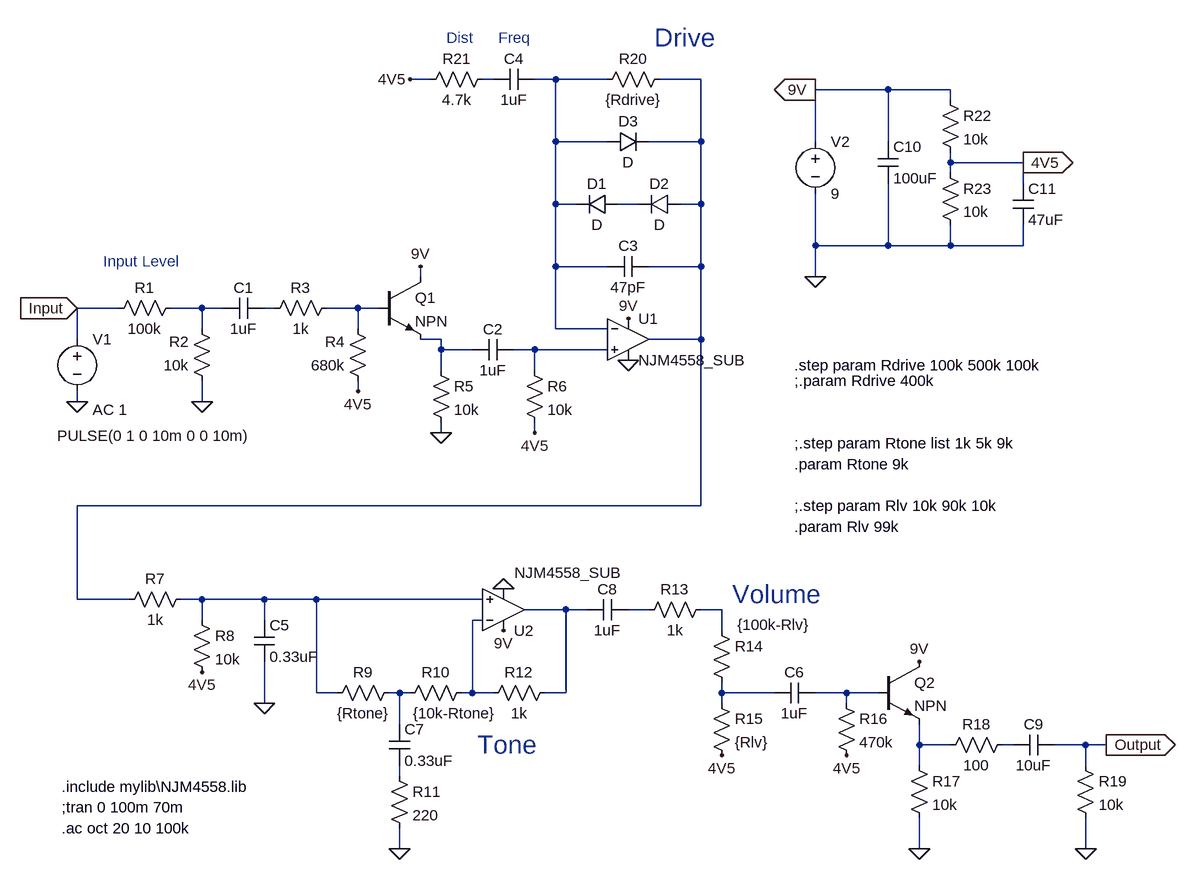
[diagram p0: schematic TS_OD1.asc]
TS_OD1.asc, the LTspice schematic file:
Version 4
SHEET 1 2708 1040
WIRE 768 -592 736 -592
WIRE 864 -592 848 -592
WIRE 960 -592 928 -592
WIRE 1040 -592 960 -592
WIRE 1184 -592 1120 -592
WIRE 1472 -576 1360 -576
WIRE 1568 -576 1472 -576
WIRE 1568 -560 1568 -576
WIRE 960 -496 960 -592
WIRE 1040 -496 960 -496
WIRE 1184 -496 1184 -592
WIRE 1184 -496 1104 -496
WIRE 1360 -496 1360 -576
WIRE 1472 -496 1472 -576
WIRE 1568 -464 1568 -480
WIRE 1680 -464 1568 -464
WIRE 1568 -448 1568 -464
WIRE 1680 -432 1680 -464
WIRE 960 -400 960 -496
WIRE 992 -400 960 -400
WIRE 1088 -400 1056 -400
WIRE 1184 -400 1184 -496
WIRE 1184 -400 1152 -400
WIRE 1360 -336 1360 -416
WIRE 1472 -336 1472 -432
WIRE 1472 -336 1360 -336
WIRE 1568 -336 1568 -368
WIRE 1568 -336 1472 -336
WIRE 1680 -336 1680 -368
WIRE 1680 -336 1568 -336
WIRE 960 -304 960 -400
WIRE 1040 -304 960 -304
WIRE 1184 -304 1184 -400
WIRE 1184 -304 1104 -304
WIRE 752 -288 752 -304
WIRE 1360 -288 1360 -336
WIRE 288 -240 224 -240
WIRE 416 -240 368 -240
WIRE 448 -240 416 -240
WIRE 528 -240 512 -240
WIRE 656 -240 608 -240
WIRE 688 -240 656 -240
WIRE 416 -208 416 -240
WIRE 656 -208 656 -240
WIRE 960 -208 960 -304
WIRE 1040 -208 960 -208
WIRE 224 -192 224 -240
WIRE 784 -192 752 -192
WIRE 1184 -192 1184 -304
WIRE 1184 -192 1104 -192
WIRE 784 -176 784 -192
WIRE 832 -176 784 -176
WIRE 928 -176 896 -176
WIRE 1040 -176 928 -176
WIRE 784 -144 784 -176
WIRE 928 -144 928 -176
WIRE 656 -112 656 -128
WIRE 224 -96 224 -112
WIRE 416 -96 416 -128
WIRE 784 -48 784 -64
WIRE 928 -48 928 -64
WIRE 1184 64 1184 -192
WIRE 1184 64 224 64
WIRE 224 208 224 64
WIRE 304 208 224 208
WIRE 416 208 384 208
WIRE 512 208 416 208
WIRE 592 208 512 208
WIRE 848 208 592 208
WIRE 976 224 912 224
WIRE 1008 224 976 224
WIRE 1104 224 1072 224
WIRE 1216 224 1184 224
WIRE 416 240 416 208
WIRE 512 240 512 208
WIRE 848 240 832 240
WIRE 1216 256 1216 224
WIRE 592 352 592 208
WIRE 624 352 592 352
WIRE 720 352 704 352
WIRE 736 352 720 352
WIRE 832 352 832 240
WIRE 832 352 816 352
WIRE 864 352 832 352
WIRE 976 352 976 224
WIRE 976 352 944 352
WIRE 1216 352 1216 336
WIRE 1296 352 1216 352
WIRE 1408 352 1360 352
WIRE 1456 352 1408 352
WIRE 512 368 512 304
WIRE 1216 368 1216 352
WIRE 1408 368 1408 352
WIRE 720 400 720 352
WIRE 1520 432 1520 400
WIRE 1568 432 1520 432
WIRE 1664 432 1648 432
WIRE 1776 432 1728 432
WIRE 1808 432 1776 432
WIRE 1520 464 1520 432
WIRE 1776 464 1776 432
WIRE 720 480 720 464
WIRE 720 592 720 560
WIRE 1520 592 1520 544
WIRE 1776 592 1776 544
FLAG 416 320 4V5
FLAG 512 368 0
FLAG 720 592 0
FLAG 1216 448 4V5
FLAG 1520 592 0
FLAG 1520 304 9V
FLAG 1408 448 4V5
FLAG 1776 592 0
FLAG 1808 432 Output
IOPIN 1808 432 Out
FLAG 224 -240 Input
IOPIN 224 -240 In
FLAG 880 256 9V
FLAG 880 192 0
FLAG 1360 -288 0
FLAG 1360 -576 9V
IOPIN 1360 -576 Out
FLAG 1680 -464 4V5
IOPIN 1680 -464 Out
FLAG 752 -304 9V
FLAG 736 -592 4V5
FLAG 224 -96 0
FLAG 416 -96 0
FLAG 656 -112 4V5
FLAG 784 -48 0
FLAG 928 -48 4V5
FLAG 1072 -224 9V
FLAG 1072 -160 0
SYMBOL voltage 224 -208 R0
WINDOW 123 24 124 Left 2
WINDOW 39 0 0 Left 2
WINDOW 3 -31 164 Left 2
SYMATTR Value2 AC 1
SYMATTR Value PULSE(0 1 0 10m 0 0 10m)
SYMATTR InstName V1
SYMBOL res 400 192 R90
WINDOW 0 0 56 VBottom 2
WINDOW 3 32 56 VTop 2
SYMATTR InstName R7
SYMATTR Value 1k
SYMBOL res 400 224 R0
SYMATTR InstName R8
SYMATTR Value 10k
SYMBOL cap 496 240 R0
SYMATTR InstName C5
SYMATTR Value 0.33uF
SYMBOL Opamps\\opamp2 880 288 M180
WINDOW 3 17 121 Left 2
SYMATTR Value NJM4558_SUB
SYMATTR InstName U2
SYMBOL res 720 336 R90
WINDOW 0 0 56 VBottom 2
WINDOW 3 32 56 VTop 2
SYMATTR InstName R9
SYMATTR Value {Rtone}
SYMBOL res 832 336 R90
WINDOW 0 0 56 VBottom 2
WINDOW 3 32 27 VTop 2
SYMATTR InstName R10
SYMATTR Value {10k-Rtone}
SYMBOL cap 704 400 R0
SYMATTR InstName C7
SYMATTR Value 0.33uF
SYMBOL res 704 464 R0
SYMATTR InstName R11
SYMATTR Value 220
SYMBOL res 960 336 R90
WINDOW 0 0 56 VBottom 2
WINDOW 3 32 56 VTop 2
SYMATTR InstName R12
SYMATTR Value 1k
SYMBOL cap 1072 208 R90
WINDOW 0 0 32 VBottom 2
WINDOW 3 32 32 VTop 2
SYMATTR InstName C8
SYMATTR Value 1uF
SYMBOL res 1200 208 R90
WINDOW 0 0 56 VBottom 2
WINDOW 3 32 56 VTop 2
SYMATTR InstName R13
SYMATTR Value 1k
SYMBOL res 1200 240 R0
WINDOW 3 40 7 Left 2
SYMATTR Value {100k-Rlv}
SYMATTR InstName R14
SYMBOL res 1200 352 R0
SYMATTR InstName R15
SYMATTR Value {Rlv}
SYMBOL cap 1360 336 R90
WINDOW 0 0 32 VBottom 2
WINDOW 3 32 32 VTop 2
SYMATTR InstName C6
SYMATTR Value 1uF
SYMBOL res 1392 352 R0
SYMATTR InstName R16
SYMATTR Value 470k
SYMBOL npn 1456 304 R0
SYMATTR InstName Q2
SYMBOL res 1504 448 R0
SYMATTR InstName R17
SYMATTR Value 10k
SYMBOL res 1664 416 R90
WINDOW 0 0 56 VBottom 2
WINDOW 3 32 56 VTop 2
SYMATTR InstName R18
SYMATTR Value 100
SYMBOL cap 1728 416 R90
WINDOW 0 0 32 VBottom 2
WINDOW 3 32 32 VTop 2
SYMATTR InstName C9
SYMATTR Value 10uF
SYMBOL res 1760 448 R0
SYMATTR InstName R19
SYMATTR Value 10k
SYMBOL voltage 1360 -512 R0
SYMATTR InstName V2
SYMATTR Value 9
SYMBOL res 384 -256 R90
WINDOW 0 0 56 VBottom 2
WINDOW 3 32 56 VTop 2
SYMATTR InstName R1
SYMATTR Value 100k
SYMBOL res 432 -112 R180
WINDOW 0 36 76 Left 2
WINDOW 3 36 40 Left 2
SYMATTR InstName R2
SYMATTR Value 10k
SYMBOL cap 512 -256 R90
WINDOW 0 0 32 VBottom 2
WINDOW 3 32 32 VTop 2
SYMATTR InstName C1
SYMATTR Value 1uF
SYMBOL res 624 -256 R90
WINDOW 0 0 56 VBottom 2
WINDOW 3 32 56 VTop 2
SYMATTR InstName R3
SYMATTR Value 1k
SYMBOL res 672 -112 R180
WINDOW 0 36 76 Left 2
WINDOW 3 36 40 Left 2
SYMATTR InstName R4
SYMATTR Value 680k
SYMBOL npn 688 -288 R0
SYMATTR InstName Q1
SYMBOL res 768 -160 R0
SYMATTR InstName R5
SYMATTR Value 10k
SYMBOL cap 896 -192 R90
WINDOW 0 0 32 VBottom 2
WINDOW 3 32 32 VTop 2
SYMATTR InstName C2
SYMATTR Value 1uF
SYMBOL res 912 -160 R0
SYMATTR InstName R6
SYMATTR Value 10k
SYMBOL cap 1104 -320 R90
WINDOW 0 0 32 VBottom 2
WINDOW 3 32 32 VTop 2
SYMATTR InstName C3
SYMATTR Value 47pF
SYMBOL diode 1056 -416 R90
WINDOW 0 0 32 VBottom 2
WINDOW 3 32 32 VTop 2
SYMATTR InstName D1
SYMBOL diode 1152 -416 R90
WINDOW 0 0 32 VBottom 2
WINDOW 3 32 32 VTop 2
SYMATTR InstName D2
SYMBOL diode 1040 -480 R270
WINDOW 0 32 32 VTop 2
WINDOW 3 0 32 VBottom 2
SYMATTR InstName D3
SYMBOL res 1136 -608 R90
WINDOW 0 0 56 VBottom 2
WINDOW 3 32 56 VTop 2
SYMATTR InstName R20
SYMATTR Value {Rdrive}
SYMBOL cap 928 -608 R90
WINDOW 0 0 32 VBottom 2
WINDOW 3 32 32 VTop 2
SYMATTR InstName C4
SYMATTR Value 1uF
SYMBOL res 864 -608 R90
WINDOW 0 0 56 VBottom 2
WINDOW 3 32 56 VTop 2
SYMATTR InstName R21
SYMATTR Value 4.7k
SYMBOL cap 1456 -496 R0
SYMATTR InstName C10
SYMATTR Value 100uF
SYMBOL res 1552 -576 R0
SYMATTR InstName R22
SYMATTR Value 10k
SYMBOL res 1552 -464 R0
SYMATTR InstName R23
SYMATTR Value 10k
SYMBOL cap 1664 -432 R0
SYMATTR InstName C11
SYMATTR Value 47uF
SYMBOL Opamps\\opamp2 1072 -256 R0
SYMATTR InstName U1
SYMATTR Value NJM4558_SUB
TEXT 840 432 Left 4 ;Tone
TEXT 1232 200 Left 4 ;Volume
TEXT 200 496 Left 2 !.include mylib\\NJM4558.lib
TEXT 200 528 Left 2 !;tran 0 100m 70m
TEXT 200 560 Left 2 !.ac oct 20 10 100k
TEXT 1328 -32 Left 2 !;.step param Rtone list 1k 5k 9k
TEXT 1328 64 Left 2 !;.step param Rlv 10k 90k 10k
TEXT 1328 0 Left 2 !.param Rtone 9k
TEXT 1328 96 Left 2 !.param Rlv 99k
TEXT 1328 -128 Left 2 !;.param Rdrive 400k
TEXT 1328 -152 Left 2 !.step param Rdrive 100k 500k 100k
TEXT 872 -656 Left 2 ;Freq
TEXT 792 -656 Left 2 ;Dist
TEXT 264 -312 Left 2 ;Input Level
TEXT 1112 -656 Left 4 ;Drive

The netlist it stands for:
* TS_OD1.asc
V1 Input 0 PULSE(0 1 0 10m 0 0 10m) AC 1
R7 N010 N003 1k
R8 N010 4V5 10k
C5 N010 0 0.33uF
XU2 N010 N014 9V 0 N011 NJM4558_SUB  ; pins In+ In- V+ V- OUT
R9 N015 N010 {Rtone}
R10 N014 N015 {10k-Rtone}
C7 N015 N020 0.33uF
R11 N020 0 220
R12 N011 N014 1k
C8 N012 N011 1uF
R13 N013 N012 1k
R14 N013 N016 {100k-Rlv}
R15 N016 4V5 {Rlv}
C6 N017 N016 1uF
R16 N017 4V5 470k
Q2 9V N017 N018 0 NPN
R17 N018 0 10k
R18 N019 N018 100
C9 Output N019 10uF
R19 Output 0 10k
V2 9V 0 9
R1 N005 Input 100k
R2 0 N005 10k
C1 N006 N005 1uF
R3 N007 N006 1k
R4 4V5 N007 680k
Q1 9V N007 N008 0 NPN
R5 N008 0 10k
C2 N009 N008 1uF
R6 N009 4V5 10k
C3 N003 N002 47pF
D1 N004 N002 D
D2 N003 N004 D
D3 N002 N003 D
R20 N003 N002 {Rdrive}
C4 N002 N001 1uF
R21 N001 4V5 4.7k
C10 9V 0 100uF
R22 9V 4V5 10k
R23 4V5 0 10k
C11 4V5 0 47uF
XU1 N009 N002 9V 0 N003 NJM4558_SUB  ; pins In+ In- V+ V- OUT
.model D D
.lib standard.dio
.model NPN NPN
.model PNP PNP
.lib standard.bjt
* Tone
* Volume
.include mylib\NJM4558.lib
;tran 0 100m 70m
.ac oct 20 10 100k
;.step param Rtone list 1k 5k 9k
;.step param Rlv 10k 90k 10k
.param Rtone 9k
.param Rlv 99k
;.param Rdrive 400k
.step param Rdrive 100k 500k 100k
* Freq
* Dist
* Input Level
* Drive
.backanno
.end